# EAGLE schematic tb-light (EAGLE 7.1.0)
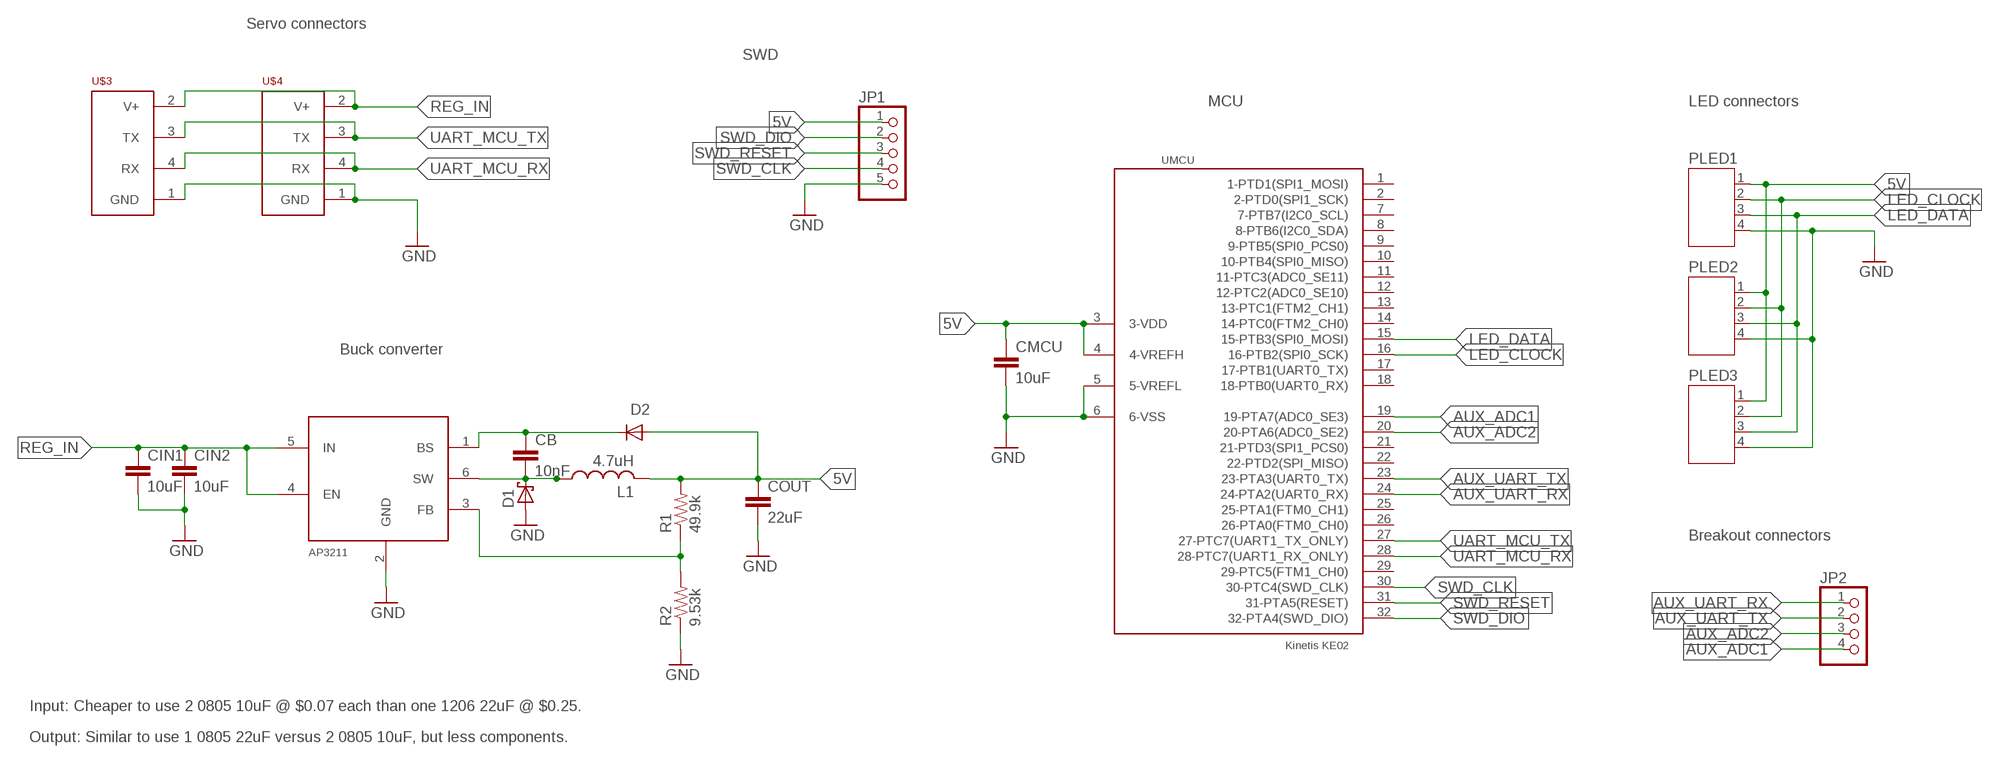
[diagram p0: schematic, sheet 1]

## Parts
CB  10nF  CAPACITOR_0805  [C0805]
CIN1  10uF  CAPACITOR_0805  [C0805]
CIN2  10uF  CAPACITOR_0805  [C0805]
CMCU  10uF  CAPACITOR_0805  [C0805]
COUT  22uF  CAPACITOR_0805  [C0805]
D1  SCHOTTKY  [SOD-123FL]
D2  SMALL-SIGNALSOD-123  [SOD-123]
JP1  PINHD-1X5  [1X05]
JP2  PINHD-1X4  [1X04]
L1  4.7uH  INDUCTOR  [L_NR6028]
PLED1  JST-PH4  [JST-PH4]
PLED2  JST-PH4  [JST-PH4]
PLED3  JST-PH4  [JST-PH4]
R1  49.9k  RESISTOR_0805  [R0805]
R2  9.53k  RESISTOR_0805  [R0805]
U$3  SERVO-CONNVERT  [TE-AMP-4PIN]
U$4  SERVO-CONNVERT  [TE-AMP-4PIN]
UMCU  KE02  [TQFP32-08]
UREG  AP3211  [SOT23-6]

## Nets
5V: CMCU.1 COUT.1 D2.A JP1.1 L1.P$2 PLED1.1 PLED2.1 PLED3.1 R1.2 UMCU.3(3-VDD) UMCU.4(4-VREFH)
AUX_ADC1: JP2.4 UMCU.19(19-PTA7(ADC0_SE3))
AUX_ADC2: JP2.3 UMCU.20(20-PTA6(ADC0_SE2))
AUX_UART_RX: JP2.1 UMCU.24(24-PTA2(UART0_RX))
AUX_UART_TX: JP2.2 UMCU.23(23-PTA3(UART0_TX))
GND: CIN1.2 CIN2.2 CMCU.2 COUT.2 D1.A JP1.5 PLED1.4 PLED2.4 PLED3.4 R2.1 U$3.1(GND) U$4.1(GND) UMCU.5(5-VREFL) UMCU.6(6-VSS) UREG.2(GND)
LED_CLOCK: PLED1.2 PLED2.2 PLED3.2 UMCU.16(16-PTB2(SPI0_SCK))
LED_DATA: PLED1.3 PLED2.3 PLED3.3 UMCU.15(15-PTB3(SPI0_MOSI))
N$1: R1.1 R2.2 UREG.3(FB)
N$2: CB.2 D1.C L1.P$1 UREG.6(SW)
N$3: CB.1 D2.C UREG.1(BS)
REG_IN: CIN1.1 CIN2.1 U$3.2(V+) U$4.2(V+) UREG.4(EN) UREG.5(IN)
SWD_CLK: JP1.4 UMCU.30(30-PTC4(SWD_CLK))
SWD_DIO: JP1.2 UMCU.32(32-PTA4(SWD_DIO))
SWD_RESET: JP1.3 UMCU.31(31-PTA5(RESET))
UART_MCU_RX: U$3.4(RX) U$4.4(RX) UMCU.28(28-PTC7(UART1_RX_ONLY))
UART_MCU_TX: U$3.3(TX) U$4.3(TX) UMCU.27(27-PTC7(UART1_TX_ONLY))
Unconnected: UMCU.1(1-PTD1(SPI1_MOSI)) UMCU.2(2-PTD0(SPI1_SCK)) UMCU.7(7-PTB7(I2C0_SCL)) UMCU.8(8-PTB6(I2C0_SDA)) UMCU.9(9-PTB5(SPI0_PCS0)) UMCU.10(10-PTB4(SPI0_MISO)) UMCU.11(11-PTC3(ADC0_SE11)) UMCU.12(12-PTC2(ADC0_SE10)) UMCU.13(13-PTC1(FTM2_CH1)) UMCU.14(14-PTC0(FTM2_CH0)) UMCU.17(17-PTB1(UART0_TX)) UMCU.18(18-PTB0(UART0_RX)) UMCU.21(21-PTD3(SPI1_PCS0)) UMCU.22(22-PTD2(SPI_MISO)) UMCU.25(25-PTA1(FTM0_CH1)) UMCU.26(26-PTA0(FTM0_CH0)) UMCU.29(29-PTC5(FTM1_CH0))

## Notes on the sheet
- Servo connectors
- SWD
- MCU | LED connectors
- Buck converter
- Breakout connectors
- Input: Cheaper to use 2 0805 10uF @ $0.07 each than one 1206 22uF @ $0.25.
- Output: Similar to use 1 0805 22uF versus 2 0805 10uF, but less components.

## Library data of the parts
CB = jared-common-parts:CAPACITOR; DIGIKEY#: 1276-1015-1-ND
CIN1 CIN2 CMCU = jared-common-parts:CAPACITOR; DIGIKEY#: 490-5523-1-ND
COUT = jared-common-parts:CAPACITOR; DIGIKEY#: 490-10511-1-ND
D1 = jared-common-diodes:SCHOTTKY; DIGIKEY#: DB2X41500LCT-ND
D2 = jared-common-diodes:SMALL-SIGNAL; DIGIKEY#: 1N4148W-FDICT-ND
JP1 = pinhead:PINHD-1X5: PIN HEADER; DIGIKEY#: MANUAL_PLACE
JP2 = pinhead:PINHD-1X4: PIN HEADER; DIGIKEY#: DNP
L1 = jared-common-parts:INDUCTOR; DIGIKEY#: 587-2100-1-ND
PLED1-PLED3 = jst-ph:JST-PH4; DIGIKEY#: 455-1706-ND
R1 = jared-common-parts:RESISTOR; DIGIKEY#: 311-49.9KCRCT-ND
R2 = jared-common-parts:RESISTOR; DIGIKEY#: 311-9.53KCRCT-ND
U$3 U$4 = jared-common-conns:SERVO-CONN; DIGIKEY#: A98779-ND
UMCU = jared-mcu:KE02; DIGIKEY#: MKE02Z32VLC4-ND
UREG = jared-common-reg:AP3211; DIGIKEY#: AP3211KTR-G1DICT-ND